# EAGLE design Battery manage1 (EAGLE 7.6.0)
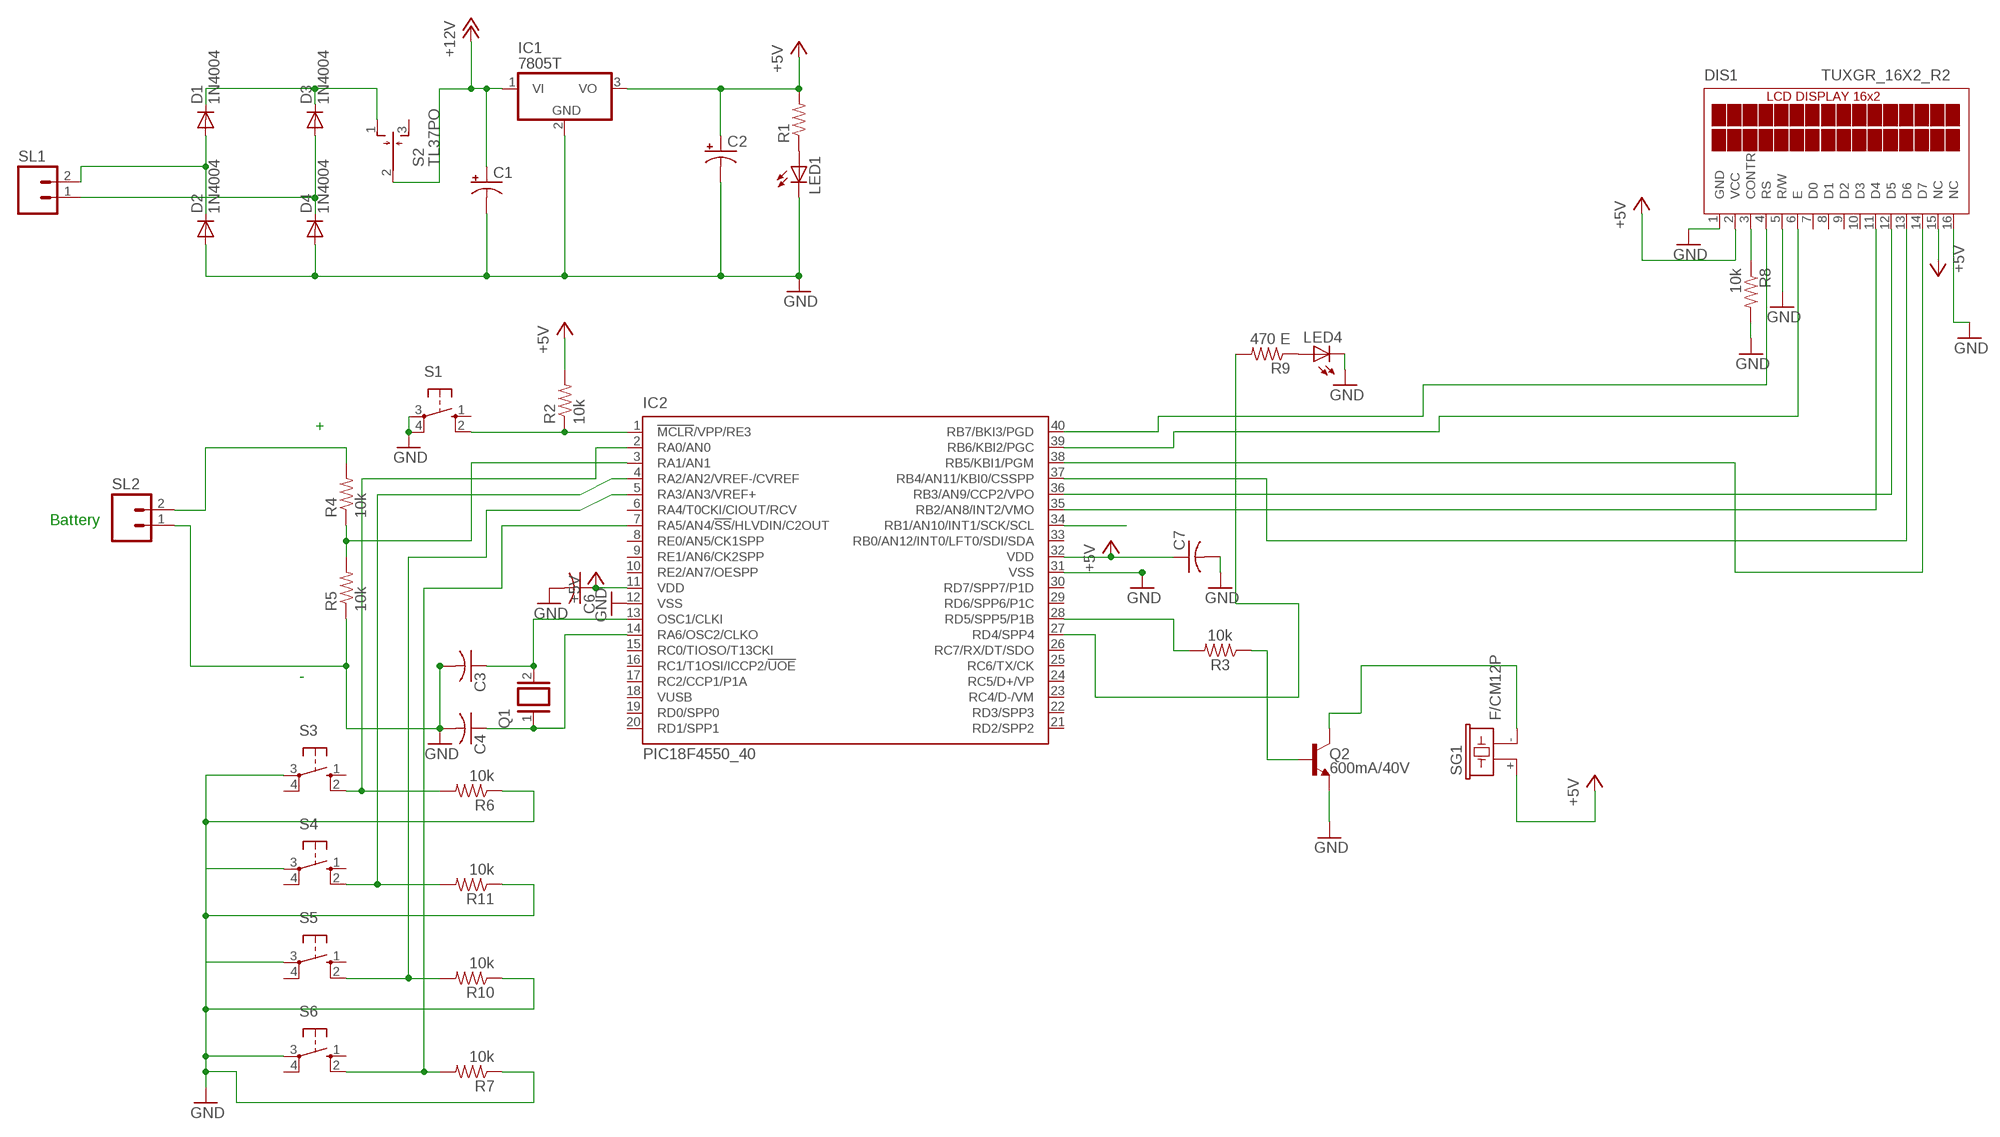
[diagram p0: schematic, sheet 1]

## Parts
C1  CPOL-USE3.5-8  [E3,5-8]
C2  CPOL-USE3.5-8  [E3,5-8]
C3  C-US025-024X044  [C025-024X044]
C4  C-US025-024X044  [C025-024X044]
C6  C-US025-024X044  [C025-024X044]
C7  C-US025-024X044  [C025-024X044]
D1  1N4004  [DO41-10]
D2  1N4004  [DO41-10]
D3  1N4004  [DO41-10]
D4  1N4004  [DO41-10]
DIS1  TUXGR_16X2_R2  [TUXGR_16X2_R2]
IC1  7805T  [TO220H]
IC2  PIC18F4550_40  [DIL40]
LED1  LED5MM  [LED5MM]
LED4  LED5MM  [LED5MM]
Q1  XTAL/S  [QS]
Q2  600mA/40V  TRANS_NPN-P2N2222A  [TO-92]
R1  R-US_0207/10  [0207/10]
R2  10k  R-US_0207/10  [0207/10]
R3  10k  10KOHM-HORIZ-1/4W-1%  [AXIAL-0.3]
R4  10k  R-US_0207/10  [0207/10]
R5  10k  R-US_0207/10  [0207/10]
R6  10k  R-US_0207/10  [0207/10]
R7  10k  R-US_0207/10  [0207/10]
R8  10k  R-US_0207/10  [0207/10]
R9  470 E  R-US_0207/10  [0207/10]
R10  10k  R-US_0207/10  [0207/10]
R11  10k  R-US_0207/10  [0207/10]
S1  10-XX  [B3F-10XX]
S2  TL37PO  [TL3XPO]
S3  10-XX  [B3F-10XX]
S4  10-XX  [B3F-10XX]
S5  10-XX  [B3F-10XX]
S6  10-XX  [B3F-10XX]
SG1  F/CM12P  [F/CM12P]
SL1  MA02  [02PA]
SL2  MA02  [02PA]

## Nets
+5V: C2.+ C6.1 C7.1 DIS1.2(VCC) DIS1.15(NC) IC1.3(VO) IC2.11(VDD) IC2.32(VDD) R1.2 R2.2 SG1.+
+12V: C1.+ IC1.1(VI) S2.2(P)
GND: C1.- C2.- C3.2 C4.2 C6.2 C7.2 D2.A D4.A DIS1.1(GND) DIS1.5(R/W) DIS1.16(NC) IC1.2(GND) IC2.12(VSS) IC2.31(VSS) LED1.K(C) LED4.K(C) Q2.3(E) R5.1 R6.1 R7.1 R8.2 R10.1 R11.1 S1.3(P) S1.4(P1) S3.3(P) S4.3(P) S5.3(P) S6.3(P) SL2.1
N$2: D1.A D2.C SL1.2
N$3: D3.A D4.C SL1.1
N$4: IC2.2(RA0/AN0) R6.2 S3.2(S1)
N$5: IC2.34(RB1/AN10/INT1/SCK/SCL)
N$6: LED1.A R1.1
N$7: IC2.4(RA2/AN2/VREF-/CVREF) R11.2 S4.2(S1)
N$8: DIS1.11(D4) IC2.35(RB2/AN8/INT2/VMO)
N$9: R4.2 SL2.2
N$10: IC2.28(RD5/SPP5/P1B) R3.P$2
N$11: IC2.1(!MCLR!/VPP/RE3) R2.1 S1.2(S1)
N$12: Q2.2(B) R3.P$1
N$13: DIS1.4(RS) IC2.40(RB7/BKI3/PGD)
N$14: DIS1.6(E) IC2.39(RB6/KBI2/PGC)
N$15: Q2.1(C) SG1.-
N$16: IC2.27(RD4/SPP4) R9.2
N$17: LED4.A R9.1
N$18: IC2.3(RA1/AN1) R4.1 R5.2
N$19: IC2.5(RA3/AN3/VREF+) R10.2 S5.2(S1)
N$20: IC2.7(RA5/AN4/!SS!/HLVDIN/C2OUT) R7.2 S6.2(S1)
N$24: C4.1 IC2.14(RA6/OSC2/CLKO) Q1.1
N$25: C3.1 IC2.13(OSC1/CLKI) Q1.2
N$26: DIS1.14(D7) IC2.38(RB5/KBI1/PGM)
N$27: DIS1.13(D6) IC2.37(RB4/AN11/KBI0/CSSPP)
N$28: DIS1.12(D5) IC2.36(RB3/AN9/CCP2/VPO)
N$30: DIS1.3(CONTR) R8.1
N$114: D1.C D3.C S2.1(O)
Unconnected: DIS1.7(D0) DIS1.8(D1) DIS1.9(D2) DIS1.10(D3) IC2.6(RA4/T0CKI/CIOUT/RCV) IC2.8(RE0/AN5/CK1SPP) IC2.9(RE1/AN6/CK2SPP) IC2.10(RE2/AN7/OESPP) IC2.15(RC0/TIOSO/T13CKI) IC2.16(RC1/T1OSI/ICCP2/!UOE) IC2.17(RC2/CCP1/P1A) IC2.18(VUSB) IC2.19(RD0/SPP0) IC2.20(RD1/SPP1) IC2.21(RD2/SPP2) IC2.22(RD3/SPP3) IC2.23(RC4/D-/VM) IC2.24(RC5/D+/VP) IC2.25(RC6/TX/CK) IC2.26(RC7/RX/DT/SDO) IC2.29(RD6/SPP6/P1C) IC2.30(RD7/SPP7/P1D) IC2.33(RB0/AN12/INT0/LFT0/SDI/SDA) S1.1(S) S2.3(S) S3.1(S) S3.4(P1) S4.1(S) S4.4(P1) S5.1(S) S5.4(P1) S6.1(S) S6.4(P1)

## Notes on the sheet
- +
- Battery
- -

## Library data of the parts
C1 C2 = adafruit:CPOL-US: POLARIZED CAPACITOR, American symbol
C3 C4 C6 C7 = adafruit:C-US: CAPACITOR, American symbol
D1-D4 = diode:1N4004: DIODE general purpose rectifier, 1 A
DIS1 = display-lcd:TUXGR_16X2_R2: Tuxgraphics LCD display 16x2 characters reflective, without background light Source: tuxgr_12x2_r2.pdf; OC_FARNELL: unknown; OC_NEWARK: unknown
IC1 = adafruit:78*: Positive VOLTAGE REGULATOR Added bigger pads to the TO-92 package
IC2 = microchip:PIC18F4*_40: USB Microcontrollers with nanoWatt Technology High-Performance, Enhanced Flash, 28/40/44-Pin, Source: http://ww1.microchip.com/downloads/en/devicedoc/39632c.pdf; MF: MICROCHIP; MPN: PIC18F4550-I/P; OC_FARNELL: 9321357; OC_NEWARK: 74K8623
LED1 LED4 = adafruit:LED: LED OSRAM: - CHIPLED LG R971, LG N971, LY N971, LG Q971, LY Q971, LO R971, LY R971 LH N974, LH R974 LS Q976, LO Q976, LY Q976 LO Q996 - Hyper CHIPLED LW Q18S LB Q993, LB Q99A, LB R99A - SideLED LS A670, LO A670, LY A670, LG A670, LP A670 LB A673, LV A673, LT A673, LW A673 LH A674 LY A675 LS A676, LA A676, LO A676, LY A676, LW A676 LS A679, LY A679, LG A679 - Hyper Micro SIDELED® LS Y876, LA Y876, LO Y876, LY Y876 LT Y87S - SmartLED LW L88C, LW L88S LB L89C, LB L89S, LG L890 LS L89K, LO L89K, LY L89K LS L896, LA L896, LO L896, LY L896 - TOPLED LS T670, LO T670, LY T670, LG T670, LP T670 LSG T670, LSP T670, LSY T670, LOP T670, LYG T670 LG T671, LOG T671, LSG T671 LB T673, LV T673, LT T673, LW T673 LH T674 LS T676, LA T676, LO T676, LY T676, LB T676, LH T676, LSB T676, LW T676 LB T67C, LV T67C, LT T67C, LS T67K, LO T67K, LY T67K, LW E67C LS E67B, LA E67B, LO E67B, LY E67B, LB E67C, LV E67C, LT E67C LW T67C LS T679, LY T679, LG T679 LS T770, LO T770, LY T770, LG T770, LP T770 LB T773, LV T773, LT T773, LW T773 LH T774 LS E675, LA E675, LY E675, LS T675 LS T776, LA T776, LO T776, LY T776, LB T776 LHGB T686 LT T68C, LB T68C - Hyper Mini TOPLED® LB M676 - Mini TOPLED Santana® LG M470 LS M47K, LO M47K, LY M47K Source: http://www.osram.convergy.de/
Q1 = special:XTAL/S: CRYSTAL
Q2 = SparkFun-DiscreteSemi:TRANS_NPN: NPN transistor Current controlled devices typically used to amplify current or used as a switch. BC547 - COM-08928 <http://www.sparkfun.com/products/8928> (TO-92 45V 100mA) (1.Collector 2.Base 3.Emitter) 2N3904 - COM-00521 <http://www.sparkfun.com/products/521> (TO-92 40V 200mA) (1.Emitter 2.Base 3.Collector) P2N2222A - COM-12852 <http://www.sparkfun.com/products/12852> (TO-92 40V 600mA) (1.Collector 2.Base 3.Emitter); PROD_ID: TRANS-09536
R1 R2 R4-R11 = adafruit:R-US_: RESISTOR, American symbol
R3 = SparkFun-Resistors:10KOHM: 10kΩ resistor A resistor is a passive two-terminal electrical component that implements electrical resistance as a circuit element. Resistors act to reduce current flow, and, at the same time, act to lower voltage levels within circuits. - Wikipedia; PROD_ID: RES-12183
S1 S3-S6 = switch-omron:10-XX: OMRON SWITCH; MPN: B3F-1000; OC_FARNELL: 176432; OC_NEWARK: 36M3542
S2 = switch:TL37PO: TINY SWITCH MOM OFF MOM Source: http://www2.produktinfo.conrad.com/datenblaetter/700000-724999/705152-da-01-de-Subminiaturschalter_TL_36YO.pdf
SG1 = buzzer:F/CM12P: BUZZER Source: Buerklin; OC_FARNELL: unknown; OC_NEWARK: unknown
SL1 SL2 = con-amp-quick:MA02: AMP QUICK CONNECTOR; OC_FARNELL: unknown; OC_NEWARK: unknown

## Board
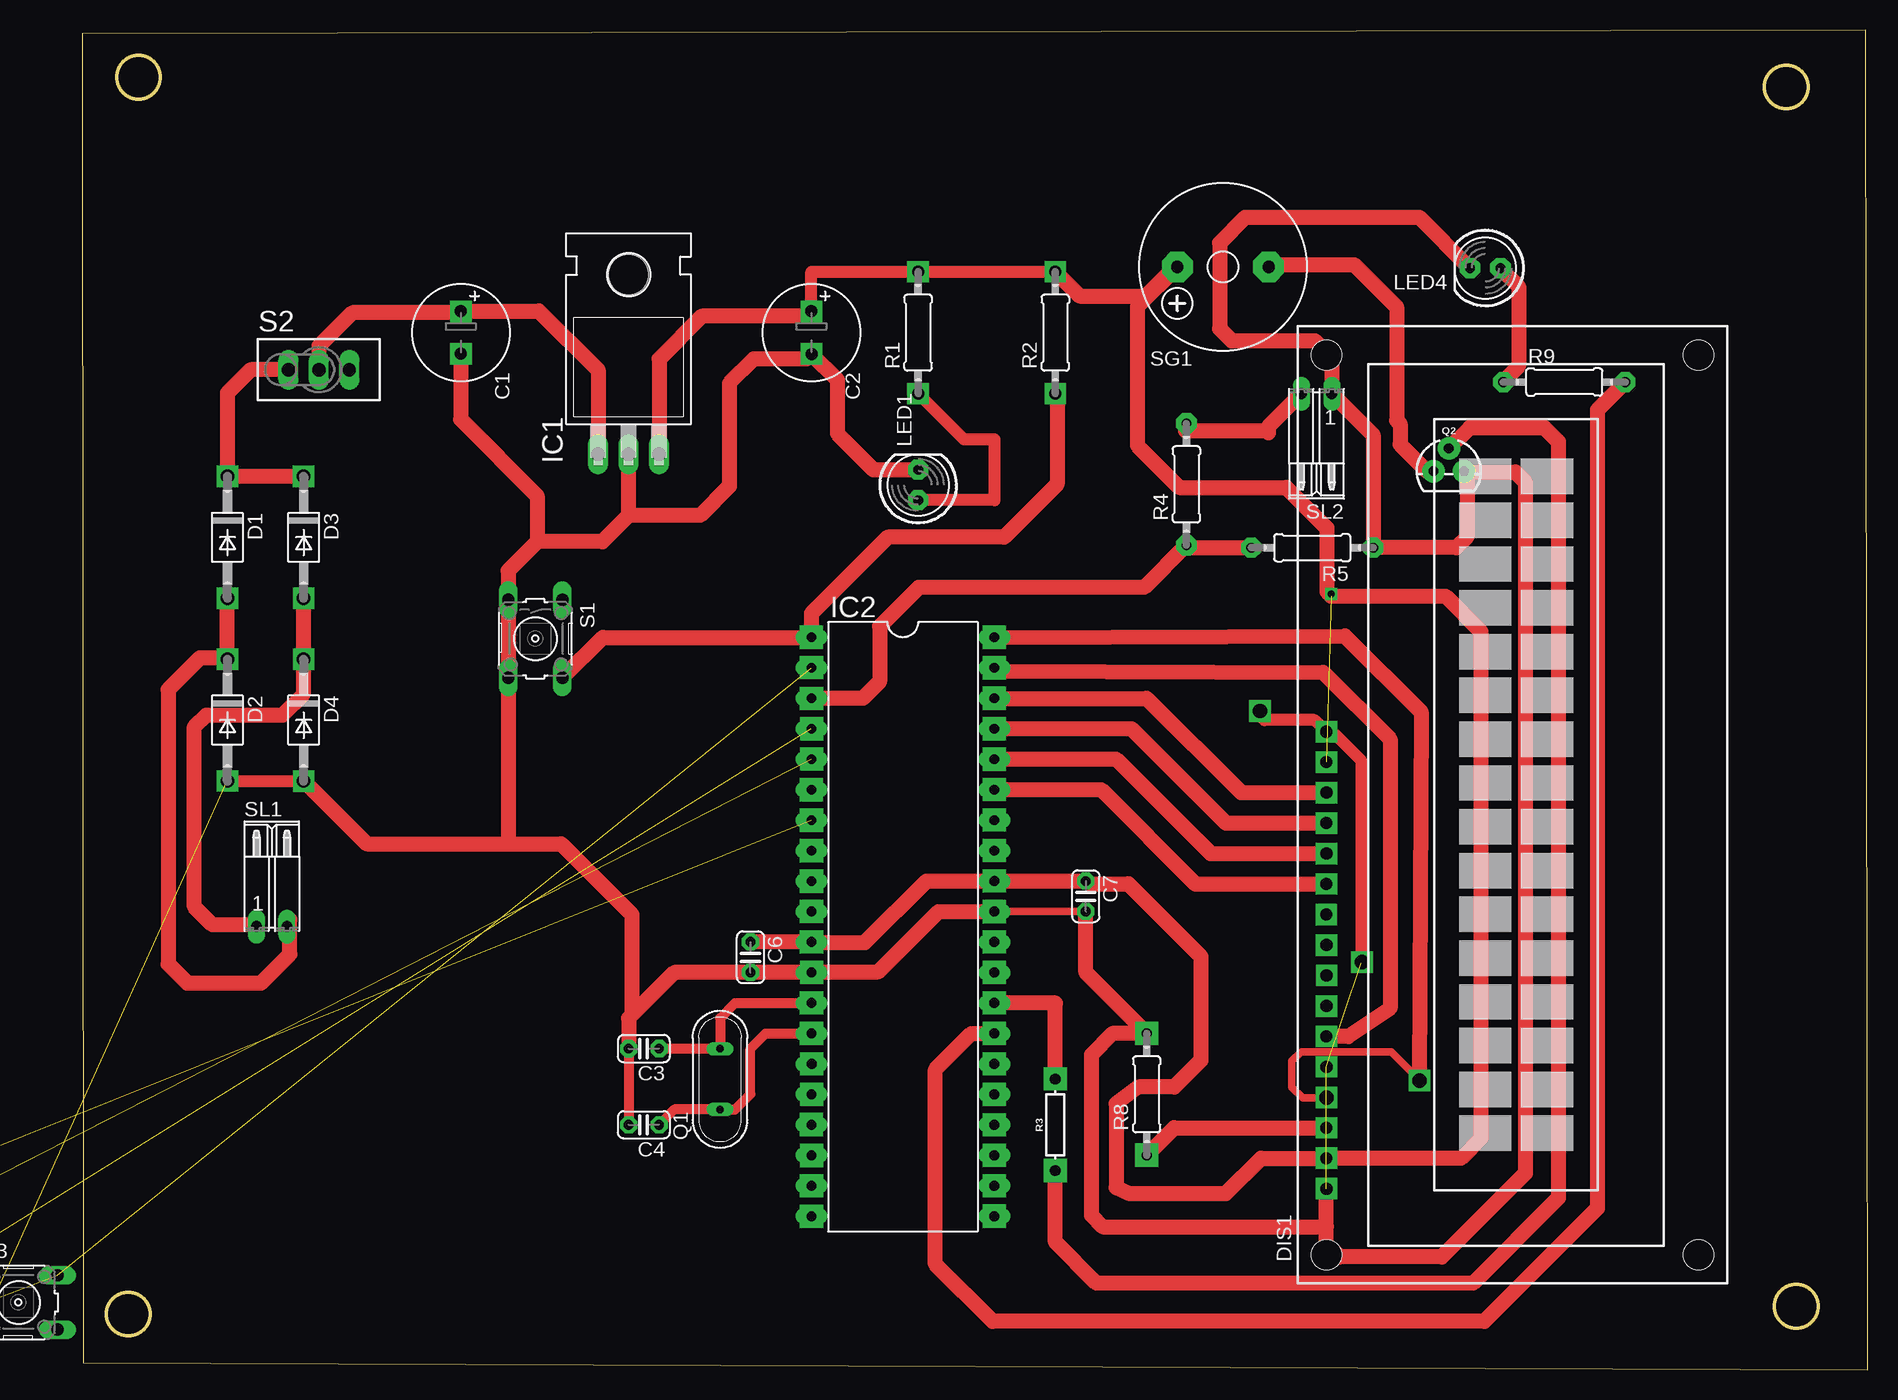
[diagram p1: board, top side]

Size 148.82 x 111.67 mm. Coordinates in mm from the lower left corner, seen from the top.
Outline: 0.08,0.55 148.82,0 148.63,111.67 0,111.36 0.08,0.55
Outline: circle at 4.71,107.74 radius 1.8
Outline: circle at 3.84,4.63 radius 1.8
Outline: circle at 142.84,5.27 radius 1.8
Outline: circle at 142.01,106.91 radius 1.8
Copper layers (1*16): Top 0.035mm / dielectric 1.5mm / Bottom 0.035mm
Design rules "default": minimum track width 10mil, minimum drill 24mil, track to track 8mil, track to pad 8mil, pad to pad 8mil, via to via 8mil, smd to smd 8mil, copper to edge 40mil, drill to drill 8mil, minimum pad ring 10mil, minimum via ring 8mil, stop-mask expansion 4mil, vias tented up to drill 0mil, thermal gap 10mil

### Footprints (pad centres in the part's own frame; a part is rotated, then mirrored left to right if it is on the bottom)
E3,5-8 = drill 0.813 pad 1.6: + -1.778,0 | drill 0.813 pad 1.6 octagon: - 1.778,0
C025-024X044 = drill 0.813 pad 1.422 octagon: 1 -1.27,0; 2 1.27,0
DO41-10 = drill 1.118: A 5.08,0; C -5.08,0
TUXGR_16X2_R2 = drill 1 pad 1.676: 1 -32,15.5; 2 -29.46,15.5; 3 -26.92,15.5; 4 -24.38,15.5; 5 -21.84,15.5; 6 -19.3,15.5; 7 -16.76,15.5; 8 -14.22,15.5; 9 -11.68,15.5; 10 -9.14,15.5; 11 -6.6,15.5; 12 -4.06,15.5; 13 -1.52,15.5; 14 1.02,15.5; 15 3.56,15.5; 16 6.1,15.5 | hole 2.5: -37.5,-15.5; 37.5,-15.5; -37.5,15.5; 37.5,15.5
TO220H = drill 1.118 long: 1 -2.54,-10.16; 2 0,-10.16; 3 2.54,-10.16 | hole 3.302: 0,4.826
DIL40 = drill 0.813 long: 1 -24.13,-7.62; 2 -21.59,-7.62; 3 -19.05,-7.62; 4 -16.51,-7.62; 5 -13.97,-7.62; 6 -11.43,-7.62; 7 -8.89,-7.62; 8 -6.35,-7.62; 9 -3.81,-7.62; 10 -1.27,-7.62; 11 1.27,-7.62; 12 3.81,-7.62; 13 6.35,-7.62; 14 8.89,-7.62; 15 11.43,-7.62; 16 13.97,-7.62; 17 16.51,-7.62; 18 19.05,-7.62; 19 21.59,-7.62; 20 24.13,-7.62; 21 24.13,7.62; 22 21.59,7.62; 23 19.05,7.62; 24 16.51,7.62; 25 13.97,7.62; 26 11.43,7.62; 27 8.89,7.62; 28 6.35,7.62; 29 3.81,7.62; 30 1.27,7.62; 31 -1.27,7.62; 32 -3.81,7.62; 33 -6.35,7.62; 34 -8.89,7.62; 35 -11.43,7.62; 36 -13.97,7.62; 37 -16.51,7.62; 38 -19.05,7.62; 39 -21.59,7.62; 40 -24.13,7.62
LED5MM = drill 0.813 pad 1.676 octagon: A -1.27,0; K 1.27,0
QS = drill 0.61 long: 1 -2.54,0; 2 2.54,0
TO-92 = drill 0.813 pad 1.88: 1 -1.27,0; 2 0,1.905; 3 1.27,0
0207/10 = drill 0.813 pad 1.676 octagon: 1 -5.08,0; 2 5.08,0
AXIAL-0.3 = drill 0.9 pad 1.88: P$1 -3.81,0; P$2 3.81,0
B3F-10XX = drill 1.016 long: 1 -3.251,2.261; 2 3.251,2.261; 3 -3.251,-2.261; 4 3.251,-2.261
TL3XPO = drill 1.1 pad 1.422 long: 1 -2.54,0; 2 0,0; 3 2.54,0
F/CM12P = drill 1.016 pad 2.54 octagon: + 3.81,0; - -3.81,0
02PA = drill 0.914 long: 1 -1.27,0; 2 1.27,0

### Placement (x,y rotation side)
C1  31.57,86.44 270 top
C2  60.78,86.44 270 top
C3  46.81,26.75 180 top
C4  46.81,20.4 180 top
C6  55.7,34.37 270 top
C7  83.64,39.45 270 top
D1  12.11,69.38 270 top
D2  12.11,54.14 270 top
D3  18.46,69.38 270 top
D4  18.46,54.14 270 top
DIS1  119.2,47.07 90 top
IC1  45.54,86.44 0 top
IC2  68.4,36.91 270 top
LED1  69.67,73.74 90 top
LED4  116.93,91.82 180 top
Q1  53.16,24.21 90 top
Q2  113.89,74.89 0 top
R1  69.67,86.44 90 top
R2  81.1,86.44 90 top
R3  81.1,20.4 90 top
R4  92.03,73.79 90 top
R5  102.51,68.51 180 top
R6  -36.36,-3.22 0 top  (outside the outline)
R7  -36.36,-7.65 0 top  (outside the outline)
R8  88.72,22.94 90 top
R9  123.51,82.32 0 top
R10  -36.36,-12.09 0 top  (outside the outline)
R11  -36.36,-16.53 0 top  (outside the outline)
S1  37.77,60.92 270 top
S2  19.73,83.34 0 top
S3  -5.31,5.59 0 top
S4  -15.93,5.59 0 top  (outside the outline)
S5  -26.54,5.59 0 top  (outside the outline)
S6  -37.16,5.59 0 top  (outside the outline)
SG1  95.07,91.92 180 top
SL1  15.8,36.93 0 top
SL2  102.87,81.35 180 top

### Tracks (layer width: path | path; a pad name or v marks a point on that pad's centre or on a via)
+5V  (1 unrouted)
  Top 1.016: C2.+ 60.78,91.52 R1.2 R2.2
  Top 1.27: C6.1 IC2.11 60.83,35.59 65.24,35.59 70.37,40.72 IC2.32 C7.1 83.87,40.48 87.18,40.48 93.23,34.44 93.23,25.77 91.02,23.56 87.99,23.56 86.17,22.18 86.17,15.19 87.28,14.68 95.32,14.68 98.24,17.61 DIS1.2 114.92,17.61 116.57,19.26 116.57,61.52 113.62,64.47 104.09,64.47 103.73,64.83 103.73,70.15 100.35,73.52 91.43,73.52 87.93,77.03 87.93,88.59 SG1.+ 91.53,91.92 91.85,91.6 90.74,91.6 88.63,89.48 83.13,89.48 R2.2 | C2.+ 60.36,87.79 51.63,87.79 48.08,84.25 IC1.3
+12V
  Top 1.27: S2.2 19.73,85.32 22.51,88.1 31.45,88.1 C1.+ 31.6,88.25 38.07,88.25 43,83.32 IC1.1
GND  (10 unrouted)
  Top 0.61: IC2.31 C7.2
  Top 0.813: C3.2 C4.2
  Top 1.016: D2.A D4.A | 106.59,33.91 106.59,50.77 104.44,52.92 103.94,52.92 DIS1.16 102.88,53.98 102.85,53.98 102.7,54.13 98.52,54.13 98.2,54.45 98.2,54.89
  Top 1.27: 45.82,29.57 49.35,33.1 C6.2 IC2.12 60.84,33.16 66.35,33.16 71.37,38.18 IC2.31 | 45.82,29.57 45.54,29.29 C3.2 | C7.2 83.64,33.1 R8.2 88.7,28.01 85.85,28.01 84.1,26.25 84.1,12.84 85.02,11.91 103.7,11.91 | LED1.K 65.94,75.01 62.93,78.02 62.93,82.51 C2.- 60.35,84.24 55.95,84.24 53.93,82.21 53.93,73.63 51.5,71.2 45.53,71.2 | D4.A 23.7,43.82 35.5,43.82 | 35.5,43.82 39.93,43.82 45.82,37.92 45.82,29.57 | 103.7,11.91 103.7,10.48 104.79,9.38 113.32,9.38 120.28,16.34 120.28,73.97 119.43,74.81 115.24,74.81 Q2.3 115.42,74.63 115.42,69.4 114.52,68.51 R5.1 107.59,77.9 SL2.1 104.14,84.36 102.73,85.76 95.8,85.76 94.79,86.77 94.79,93.91 96.9,96.02 111.46,96.02 LED4.K | 103.7,11.91 DIS1.1 | IC1.2 45.53,76.27 45.53,71.2 | 45.53,71.2 43.35,69.02 37.92,69.02 | 37.92,69.02 35.51,66.6 S1.3 S1.4 35.5,43.82 | C1.- 31.54,84.63 31.54,79.21 37.92,72.83 37.92,69.02
N$1  (via drill 0.6)
  other vias: 104.09,64.65
N$2
  Top 1.27: D1.A D2.C 12,59.33 9.81,59.33 7.16,56.68 7.16,33.81 8.75,32.22 14.93,32.22 17.31,34.61 17.31,37.52 17.07,37.28 SL1.2
N$3
  Top 1.27: D3.A D4.C 18.46,56.33 16.69,54.56 10.34,54.56 9.36,53.59 9.36,38.58 10.87,37.08 14.38,37.08 SL1.1
N$4  (2 unrouted)
N$6
  Top 1.016: R1.1 73.48,77.55 76.02,77.55 76.02,72.47 LED1.A
N$7  (2 unrouted)
N$8
  Top 1.27: IC2.35 84.91,48.34 92.78,40.47 DIS1.11
N$9
  Top 1.27: SL2.2 98.86,78.61 98.86,78.09 98.72,78.23 91.95,78.23 92.03,78.31 R4.2
N$10
  Top 1.27: R3.P$2 81.1,30.56 IC2.28
N$11
  Top 1.27: S1.2 43.4,61.04 IC2.1 60.78,63.04 67.12,69.38 76.83,69.38 81.25,73.8 81.25,81.21 R2.1
N$12
  Top 1.27: Q2.2 115.63,78.53 121.85,78.53 123.02,77.36 123.02,14.31 115.92,7.21 84.53,7.21 81.1,10.64 R3.P$1
N$13  (via drill 1.2 pad 0.25)
  Top 0.61: DIS1.4 103.66,22.65 101.7,22.65 100.82,23.53 100.82,25.72 101.6,26.5 105.81,26.5 105.82,26.49 109.09,26.49 111.45,24.13 v111.45,24.08
  Top 1.27: IC2.40 105.22,61.17 111.57,54.82 v111.45,24.08
N$14
  Top 1.27: IC2.39 76.27,58.24 103.43,58.12 109,52.55 109,30.11 105.52,27.77 DIS1.6
N$15
  Top 1.27: SG1.- 99.07,92.1 106.02,92.1 109.53,88.58 109.53,79.12 109.83,78.82 109.83,77.11 112.05,74.89 Q2.1
N$16
  Top 1.27: R9.2 126.26,79.99 126.26,13.43 116.85,4.01 75.88,4.01 71.1,8.79 71.1,25.02 74.1,28.02 IC2.27
N$17
  Top 1.27: LED4.A 119.71,90.31 119.71,83.65 118.44,82.37 R9.1
N$18
  Top 1.27: R5.2 92.23,68.51 R4.1 88.51,65.2 69.72,65.2 66.46,61.94 66.46,57.35 65.07,55.96 IC2.3
N$19  (2 unrouted)
N$20  (2 unrouted)
N$24
  Top 0.813: C4.1 49.35,21.67 Q1.1 54.43,21.67 55.7,22.94 55.7,26.75 56.97,28.02 IC2.14
N$25
  Top 0.813: C3.1 Q1.2 53.16,29.29 54.43,30.56 IC2.13
N$26
  Top 1.27: IC2.38 88.72,55.96 96.59,48.09 DIS1.14
N$27
  Top 1.27: IC2.37 87.45,53.42 95.32,45.55 DIS1.13
N$28
  Top 1.27: IC2.36 86.18,50.88 94.05,43.01 DIS1.12
N$29  (via drill 1.2 pad 0.81)
  other vias: 103.7,22.68
N$30
  Top 1.27: R8.1 91.01,20.15 DIS1.3
N$31  (via drill 1.2 pad 0.81)
  other vias: 106.65,33.96
N$34  (via drill 1.2 pad 0.81)
  other vias: 98.17,54.89
N$35  (via drill 1 pad 1.78)
  other vias: 103.7,15.07
N$36  (via drill 1 pad 1.78)
  other vias: 103.69,17.61
N$37  (via drill 1 pad 1.78)
  other vias: 103.69,20.15
N$38  (via drill 1 pad 1.78)
  other vias: 103.71,25.23
N$39  (via drill 1 pad 1.78)
  other vias: 103.7,27.77
N$40  (via drill 1 pad 1.78)
  other vias: 103.7,30.29
N$41  (via drill 1 pad 1.78)
  other vias: 103.72,32.85
N$42  (via drill 1 pad 1.78)
  other vias: 103.7,35.38
N$43  (via drill 1 pad 1.78)
  other vias: 103.68,37.92
N$44  (via drill 1 pad 1.78)
  other vias: 103.69,40.48
N$45  (via drill 1 pad 1.78)
  other vias: 103.71,43.01
N$46  (via drill 1 pad 1.78)
  other vias: 103.69,45.55
N$47  (via drill 1 pad 1.78)
  other vias: 103.7,48.09
N$48  (via drill 1 pad 1.78)
  other vias: 103.69,50.63
N$49  (via drill 1 pad 1.78)
  other vias: 103.69,53.16
N$52  (via drill 1 pad 1.78)
  other vias: 81.1,81.35
N$53  (via drill 1 pad 1.78)
  other vias: 81.1,91.52
N$54  (via drill 1 pad 1.78)
  other vias: 69.67,91.52
N$55  (via drill 1 pad 1.78)
  other vias: 69.66,81.36
N$56  (via drill 1 pad 1.78)
  other vias: 60.78,88.22
N$57  (via drill 1 pad 1.78)
  other vias: 60.79,84.66
N$58  (via drill 1 pad 1.78)
  other vias: 31.56,88.22
N$59  (via drill 1 pad 1.78)
  other vias: 31.57,84.67
N$60  (via drill 1 pad 1.78)
  other vias: 18.46,74.46
N$61  (via drill 1 pad 1.78)
  other vias: 18.47,64.3
N$62  (via drill 1 pad 1.78)
  other vias: 18.47,59.21
N$63  (via drill 1 pad 1.78)
  other vias: 18.47,49.05
N$64  (via drill 1 pad 1.78)
  other vias: 12.11,49.06
N$65  (via drill 1 pad 1.78)
  other vias: 12.12,64.3
N$66  (via drill 1 pad 1.78)
  other vias: 12.1,74.45
N$67  (via drill 1 pad 1.78)
  other vias: 12.11,59.21
N$68  (via drill 0.8 pad 1.93)
  other vias: 60.77,61.04
N$69  (via drill 0.8 pad 1.93)
  other vias: 60.78,58.51
N$70  (via drill 0.8 pad 1.93)
  other vias: 60.78,55.95
N$71  (via drill 0.8 pad 1.93)
  other vias: 60.79,53.41
N$72  (via drill 0.8 pad 1.93)
  other vias: 60.79,50.89
N$73  (via drill 0.8 pad 1.93)
  other vias: 60.77,48.34
N$74  (via drill 0.8 pad 1.93)
  other vias: 60.78,45.79
N$75  (via drill 0.8 pad 1.93)
  other vias: 60.77,43.25
N$76  (via drill 0.8 pad 1.93)
  other vias: 60.78,40.72
N$77  (via drill 0.8 pad 1.93)
  other vias: 60.78,38.18
N$78  (via drill 0.8 pad 1.93)
  other vias: 60.78,35.64
N$79  (via drill 0.8 pad 1.93)
  other vias: 60.79,33.11
N$80  (via drill 0.8 pad 1.93)
  other vias: 60.78,30.57
N$81  (via drill 0.8 pad 1.93)
  other vias: 60.78,28.01
N$82  (via drill 0.8 pad 1.93)
  other vias: 60.8,25.48
N$83  (via drill 0.8 pad 1.93)
  other vias: 60.79,22.95
N$84  (via drill 0.8 pad 1.93)
  other vias: 60.77,20.41
N$85  (via drill 0.8 pad 1.93)
  other vias: 60.79,17.84
N$86  (via drill 0.8 pad 1.93)
  other vias: 60.78,15.32
N$87  (via drill 0.8 pad 1.93)
  other vias: 60.78,12.78
N$90  (via drill 0.8 pad 1.93)
  other vias: 76.02,12.79
N$91  (via drill 0.8 pad 1.93)
  other vias: 76.02,15.31
N$92  (via drill 0.8 pad 1.93)
  other vias: 76.01,17.86
N$93  (via drill 0.8 pad 1.93)
  other vias: 76.02,20.4
N$94  (via drill 0.8 pad 1.93)
  other vias: 76.02,22.94
N$95  (via drill 0.8 pad 1.93)
  other vias: 76.01,25.48
N$96  (via drill 0.8 pad 1.93)
  other vias: 76.01,28.02
N$97  (via drill 0.8 pad 1.93)
  other vias: 76.01,30.56
N$98  (via drill 0.8 pad 1.93)
  other vias: 76.01,33.11
N$99  (via drill 0.8 pad 1.93)
  other vias: 76.01,35.65
N$100  (via drill 0.8 pad 1.93)
  other vias: 76.02,38.17
N$101  (via drill 0.8 pad 1.93)
  other vias: 76.02,40.73
N$102  (via drill 0.8 pad 1.93)
  other vias: 76.01,43.26
N$103  (via drill 0.8 pad 1.93)
  other vias: 76.01,45.81
N$104  (via drill 0.8 pad 1.93)
  other vias: 76.02,48.35
N$105  (via drill 0.8 pad 1.93)
  other vias: 76.02,50.88
N$106  (via drill 0.8 pad 1.93)
  other vias: 76.01,53.42
N$107  (via drill 0.8 pad 1.93)
  other vias: 76.02,55.96
N$108  (via drill 0.8 pad 1.93)
  other vias: 76.02,58.5
N$109  (via drill 0.8 pad 1.93)
  other vias: 76.01,61.04
N$110  (via drill 0.8 pad 1.93)
  other vias: 88.72,28.01
N$111  (via drill 0.8 pad 1.93)
  other vias: 88.72,17.87
N$112  (via drill 0.8 pad 1.93)
  other vias: 81.09,24.22
N$113  (via drill 0.8 pad 1.93)
  other vias: 81.1,16.59
N$114
  Top 1.27: D3.C D1.C 12.11,81.41 14.05,83.35 S2.1